# EAGLE design v5 (EAGLE 6.3)

## Sheet 1 of 3
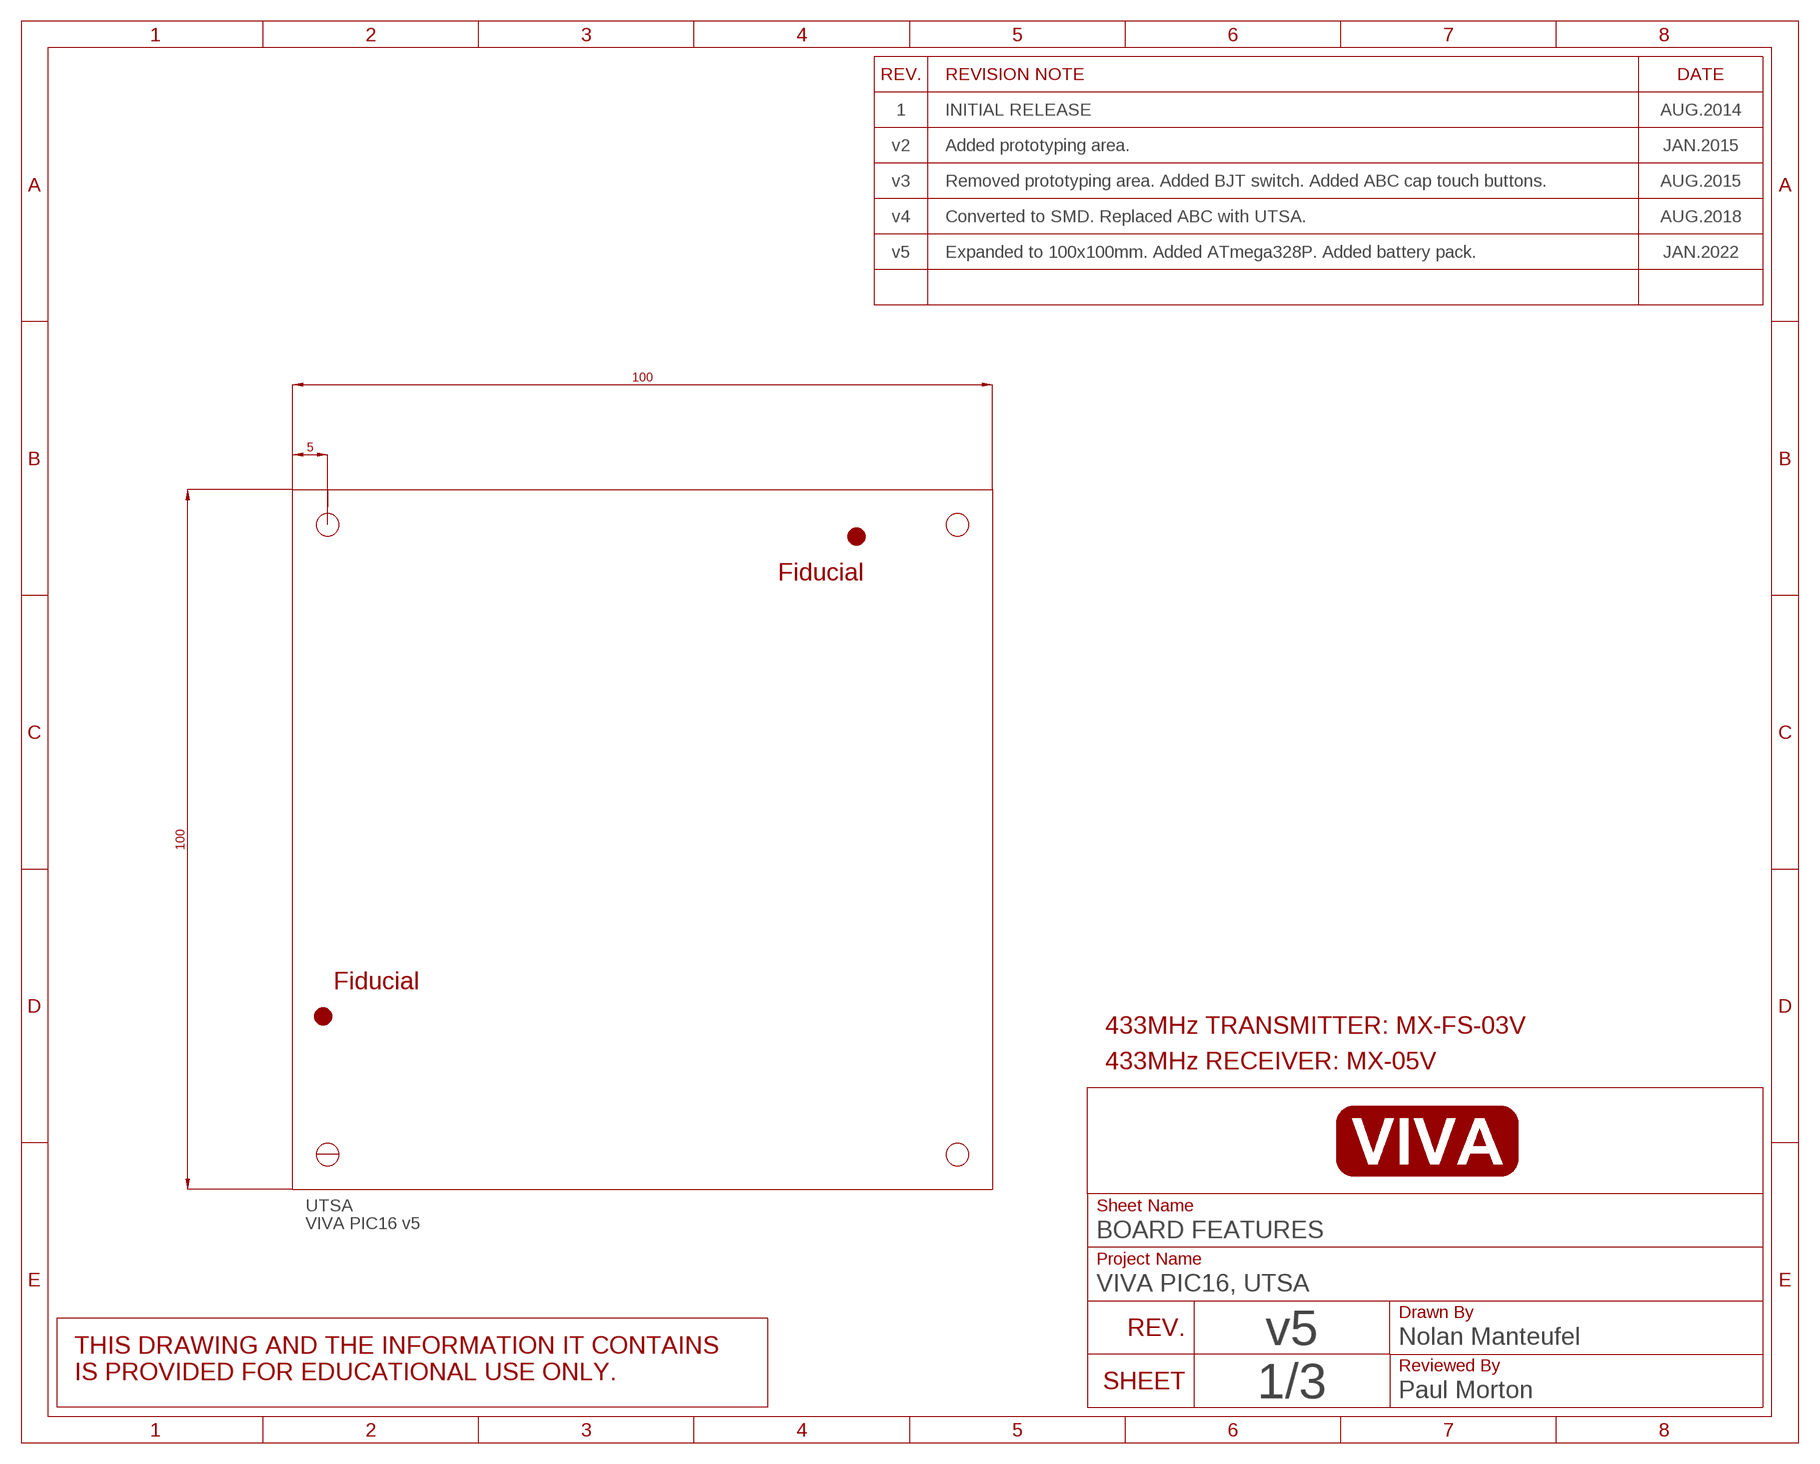
[diagram p0: schematic, sheet 1]
U$1 (SCHEMATIC_VIVA): DRAWN_BY: Nolan Manteufel; PROJECT: VIVA PIC16, UTSA; REVA: 1; REVA_DATE: AUG.2014; REVA_NOTE: INITIAL RELEASE; REVB: v2; REVB_DATE: JAN.2015; REVB_NOTE: Added prototyping area.; REVC: v3; REVC_DATE: AUG.2015; REVC_NOTE: Removed prototyping area. Added BJT switch. Added ABC cap touch buttons.; REVD: v4; REVD_DATE: AUG.2018; REVD_NOTE: Converted to SMD. Replaced ABC with UTSA.; REVE: v5; REVE_DATE: JAN.2022; REVE_NOTE: Expanded to 100x100mm. Added ATmega328P. Added battery pack.; REVIEWED_BY: Paul Morton; REVISION: v5

### Parts
FIDUCIAL1  FIDUCIAL  [FIDUCIAL]
FIDUCIAL2  FIDUCIAL  [FIDUCIAL]
UTSA  VIVA PIC16 v5  PCB_100X100  [PCB_100X100]

### Notes on the sheet
- Fiducial
- Fiducial
- 433MHz TRANSMITTER: MX-FS-03V
- 433MHz RECEIVER: MX-05V

## Sheet 2 of 3
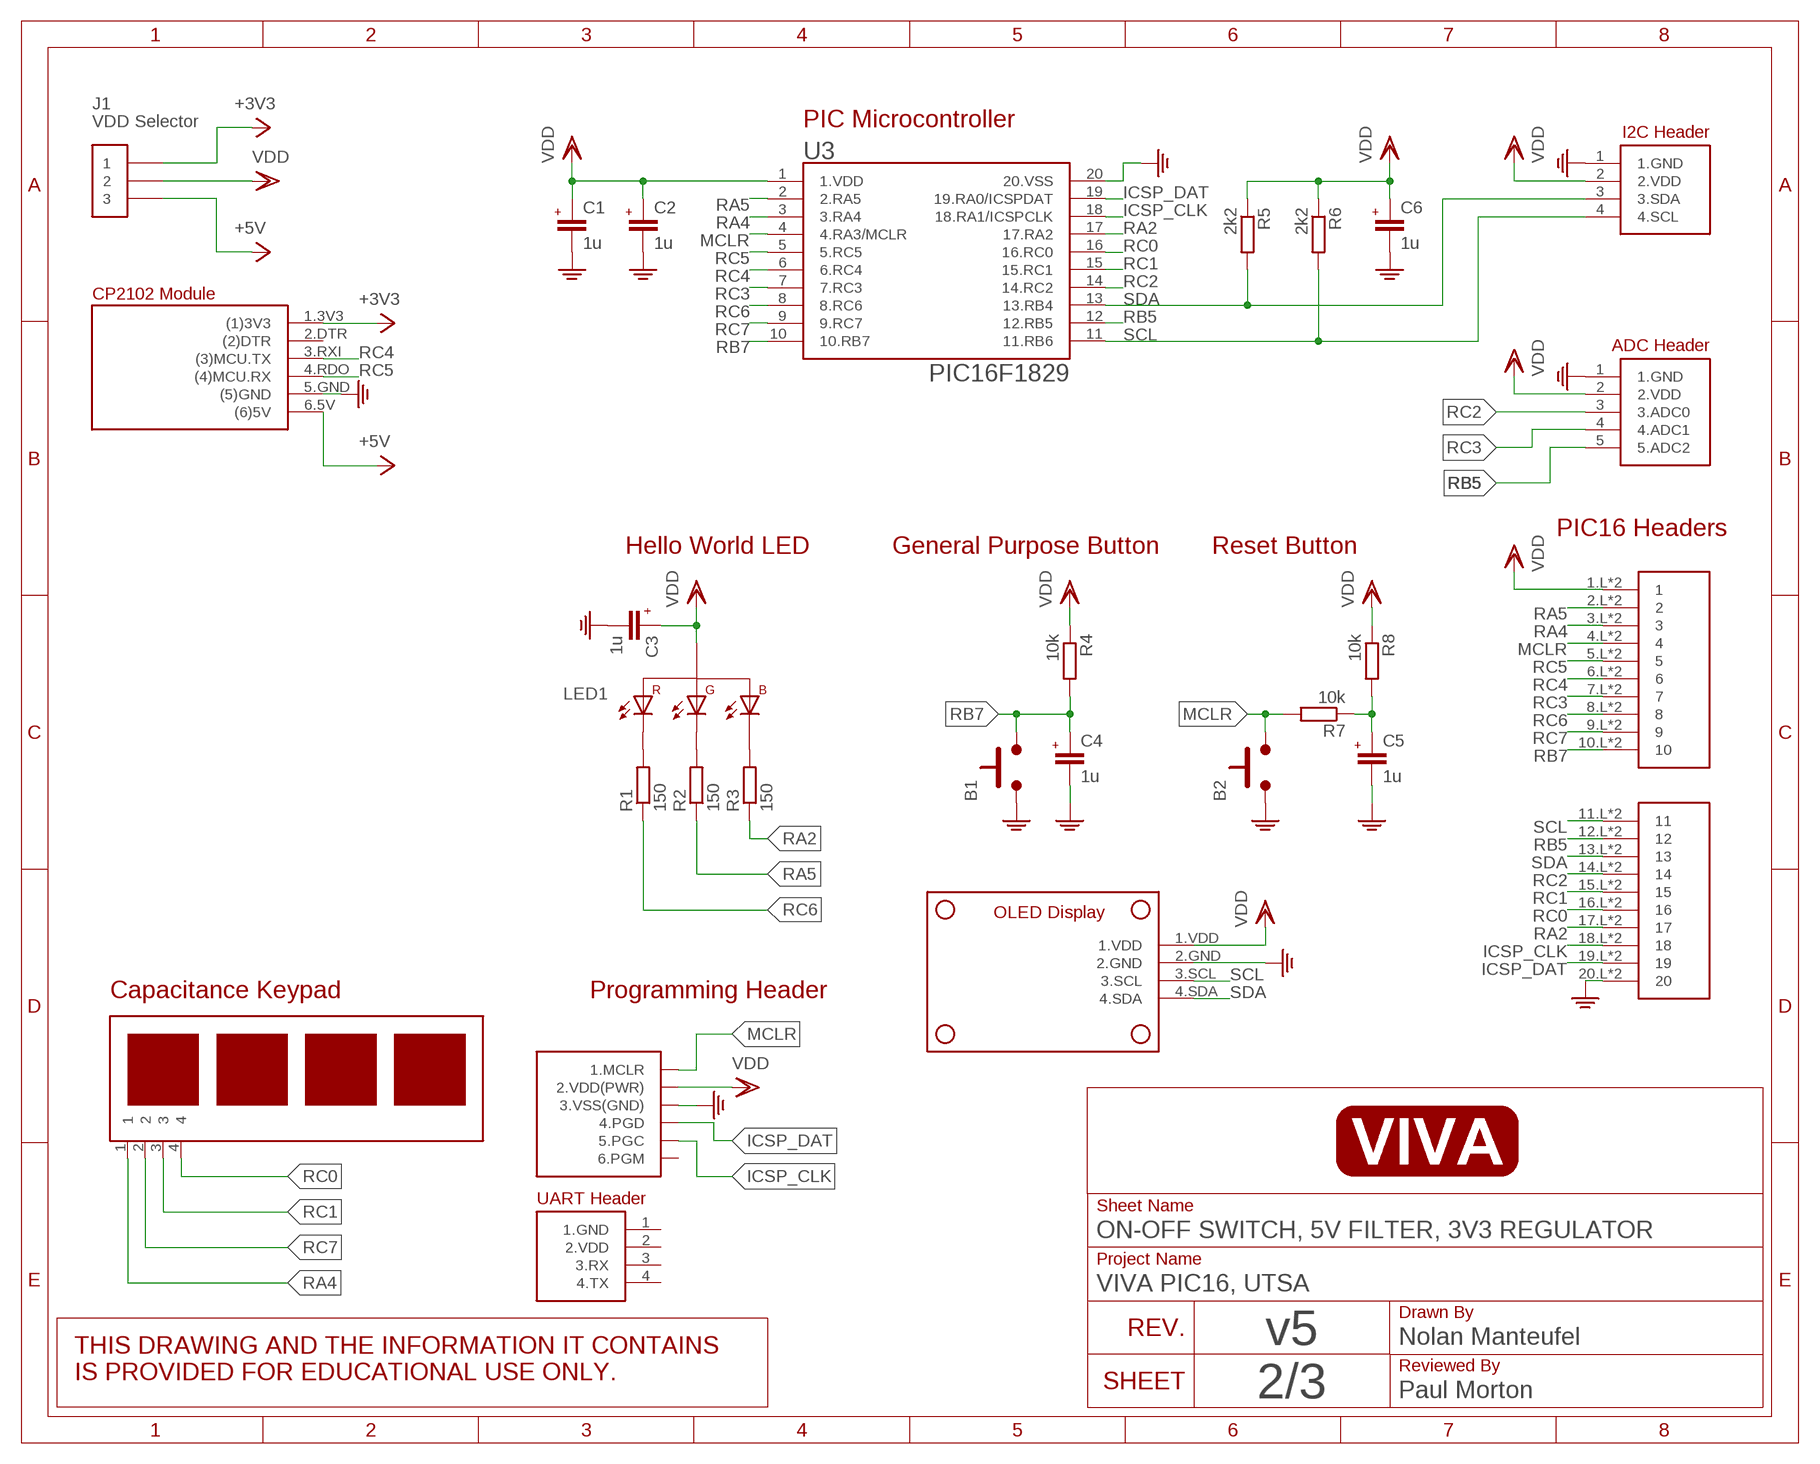
[diagram p1: schematic, sheet 2]
U$4 (SCHEMATIC_VIVA): DRAWN_BY: Nolan Manteufel; PROJECT: VIVA PIC16, UTSA; REVA: 1; REVA_DATE: AUG.2014; REVA_NOTE: INITIAL RELEASE; REVB: v2; REVB_DATE: JAN.2015; REVB_NOTE: Added prototyping area.; REVC: v3; REVC_DATE: AUG.2015; REVC_NOTE: Removed prototyping area. Added BJT switch. Added ABC cap touch buttons.; REVD: v4; REVD_DATE: AUG.2018; REVD_NOTE: Converted to SMD. Replaced ABC with UTSA.; REVE: v5; REVE_DATE: JAN.2022; REVE_NOTE: Expanded to 100x100mm. Added ATmega328P. Added battey pack.; REVIEWED_BY: Paul Morton; REVISION: v5

### Parts
B1  PUSHBUTTON6X6MM  [6X6MM]
B2  PUSHBUTTON6X6MM  [6X6MM]
C1  1u  C0805  [C0805]
C2  1u  C0805  [C0805]
C3  1u  C0805  [C0805]
C4  1u  C0805  [C0805]
C5  1u  C0805  [C0805]
C6  1u  C0805  [C0805]
J1  VDD Selector  PINS_3_2.54  [PINS_3]
J4  PICKIT3  [PICKIT3]
J5  VIVA-HEADER-ADC-PIC16  [VIVA-HEADER-ADC-PIC16]
LED1  LED_RGBLTST-C19FD1WT  [0805_RGB]
R1  150  R-EU__R0805  [R0805]
R2  150  R-EU__R0805  [R0805]
R3  150  R-EU__R0805  [R0805]
R4  10k  R-EU__R0805  [R0805]
R5  2k2  R-EU__R0805  [R0805]
R6  2k2  R-EU__R0805  [R0805]
R7  10k  R-EU__R0805  [R0805]
R8  10k  R-EU__R0805  [R0805]
U1  VIVA_UTSA-KEYPADV5  [VIVA_UTSA-KEYPAD-V5]
U2  VIVA_USB-TTL  [VIVA_USB_TTL_SUBTEXT]
U3  PIC16F1829  PIC16F1829300  [SOP20-NEW]
U4  VIVA-HEADER-I2C-RA  [VIVA-HEADER-I2C-RA]
U5  VIVA_PIC16BOARD  [VIVA_PIC16]
U$2  VIVA-HEADER-UART-XS  [PINS_4]
U$3  VIVA_OLED  [VIVA_OLED-I2C]

### Nets
+3V3: J1.1 U2.1.3V3((1)3V3) ; also sheet 3
+5V: J1.3 U2.6.5V((6)5V) ; also sheet 3
GND: B1.1.A B1.2.A B2.1.A B2.2.A C1.1(-) C2.1(-) C3.1(-) C4.1(-) C5.1(-) C6.1(-) J4.3(3.VSS(GND)) J5.1(1.GND) U2.5.GND((5)GND) U3.20(20.VSS) U4.1(1.GND) U5.20.L U5.20.R U$3.2.GND ; also sheet 3
ICSP_CLK: J4.5(5.PGC) U3.18(18.RA1/ICSPCLK) U5.18.L U5.18.R
ICSP_DAT: J4.4(4.PGD) U3.19(19.RA0/ICSPDAT) U5.19.L U5.19.R
MCLR: B2.3.B B2.4.B J4.1(1.MCLR) R7.2 U3.4(4.RA3/MCLR) U5.4.L U5.4.R
MCLR_CAP: C5.2(+) R7.1 R8.2
N$4: LED1.2(1.R-) R1.2
N$5: LED1.3(2.G-) R2.2
N$6: LED1.1(4.B-) R3.2
RA2: R3.1 U3.17(17.RA2) U5.17.L U5.17.R
RA4: U1.1 U3.3(3.RA4) U5.3.L U5.3.R
RA5: R2.1 U3.2(2.RA5) U5.2.L U5.2.R
RB5: J5.5(5.ADC2) U3.12(12.RB5) U5.12.L U5.12.R
RB7: B1.3.B B1.4.B C4.2(+) R4.2 U3.10(10.RB7) U5.10.L U5.10.R
RC0: U1.4 U3.16(16.RC0) U5.16.L U5.16.R
RC1: U1.3 U3.15(15.RC1) U5.15.L U5.15.R
RC2: J5.3(3.ADC0) U3.14(14.RC2) U5.14.L U5.14.R
RC3: J5.4(4.ADC1) U3.7(7.RC3) U5.7.L U5.7.R
RC4: U2.3.RXI((3)MCU.TX) U3.6(6.RC4) U5.6.L U5.6.R
RC5: U2.4.RDO((4)MCU.RX) U3.5(5.RC5) U5.5.L U5.5.R
RC6: R1.1 U3.8(8.RC6) U5.8.L U5.8.R
RC7: U1.2 U3.9(9.RC7) U5.9.L U5.9.R
SCL: R6.2 U3.11(11.RB6) U4.4(4.SCL) U5.11.L U5.11.R U$3.3.SCL ; also sheet 3
SDA: R5.2 U3.13(13.RB4) U4.3(3.SDA) U5.13.L U5.13.R U$3.4.SDA ; also sheet 3
VDD: C1.2(+) C2.2(+) C3.2(+) C6.2(+) J1.2 J4.2(2.VDD(PWR)) J5.2(2.VDD) LED1.4(3.+) R4.1 R5.1 R6.1 R8.1 U3.1(1.VDD) U4.2(2.VDD) U5.1.L U5.1.R U$3.1.VDD ; also sheet 3
Unconnected: J4.6(6.PGM) U2.2.DTR((2)DTR) U$2.1(1.GND) U$2.2(2.VDD) U$2.3(3.RX) U$2.4(4.TX)

### Notes on the sheet
- PIC Microcontroller
- PIC16 Headers
- Hello World LED | General Purpose Button | Reset Button
- Capacitance Keypad | Programming Header

## Sheet 3 of 3
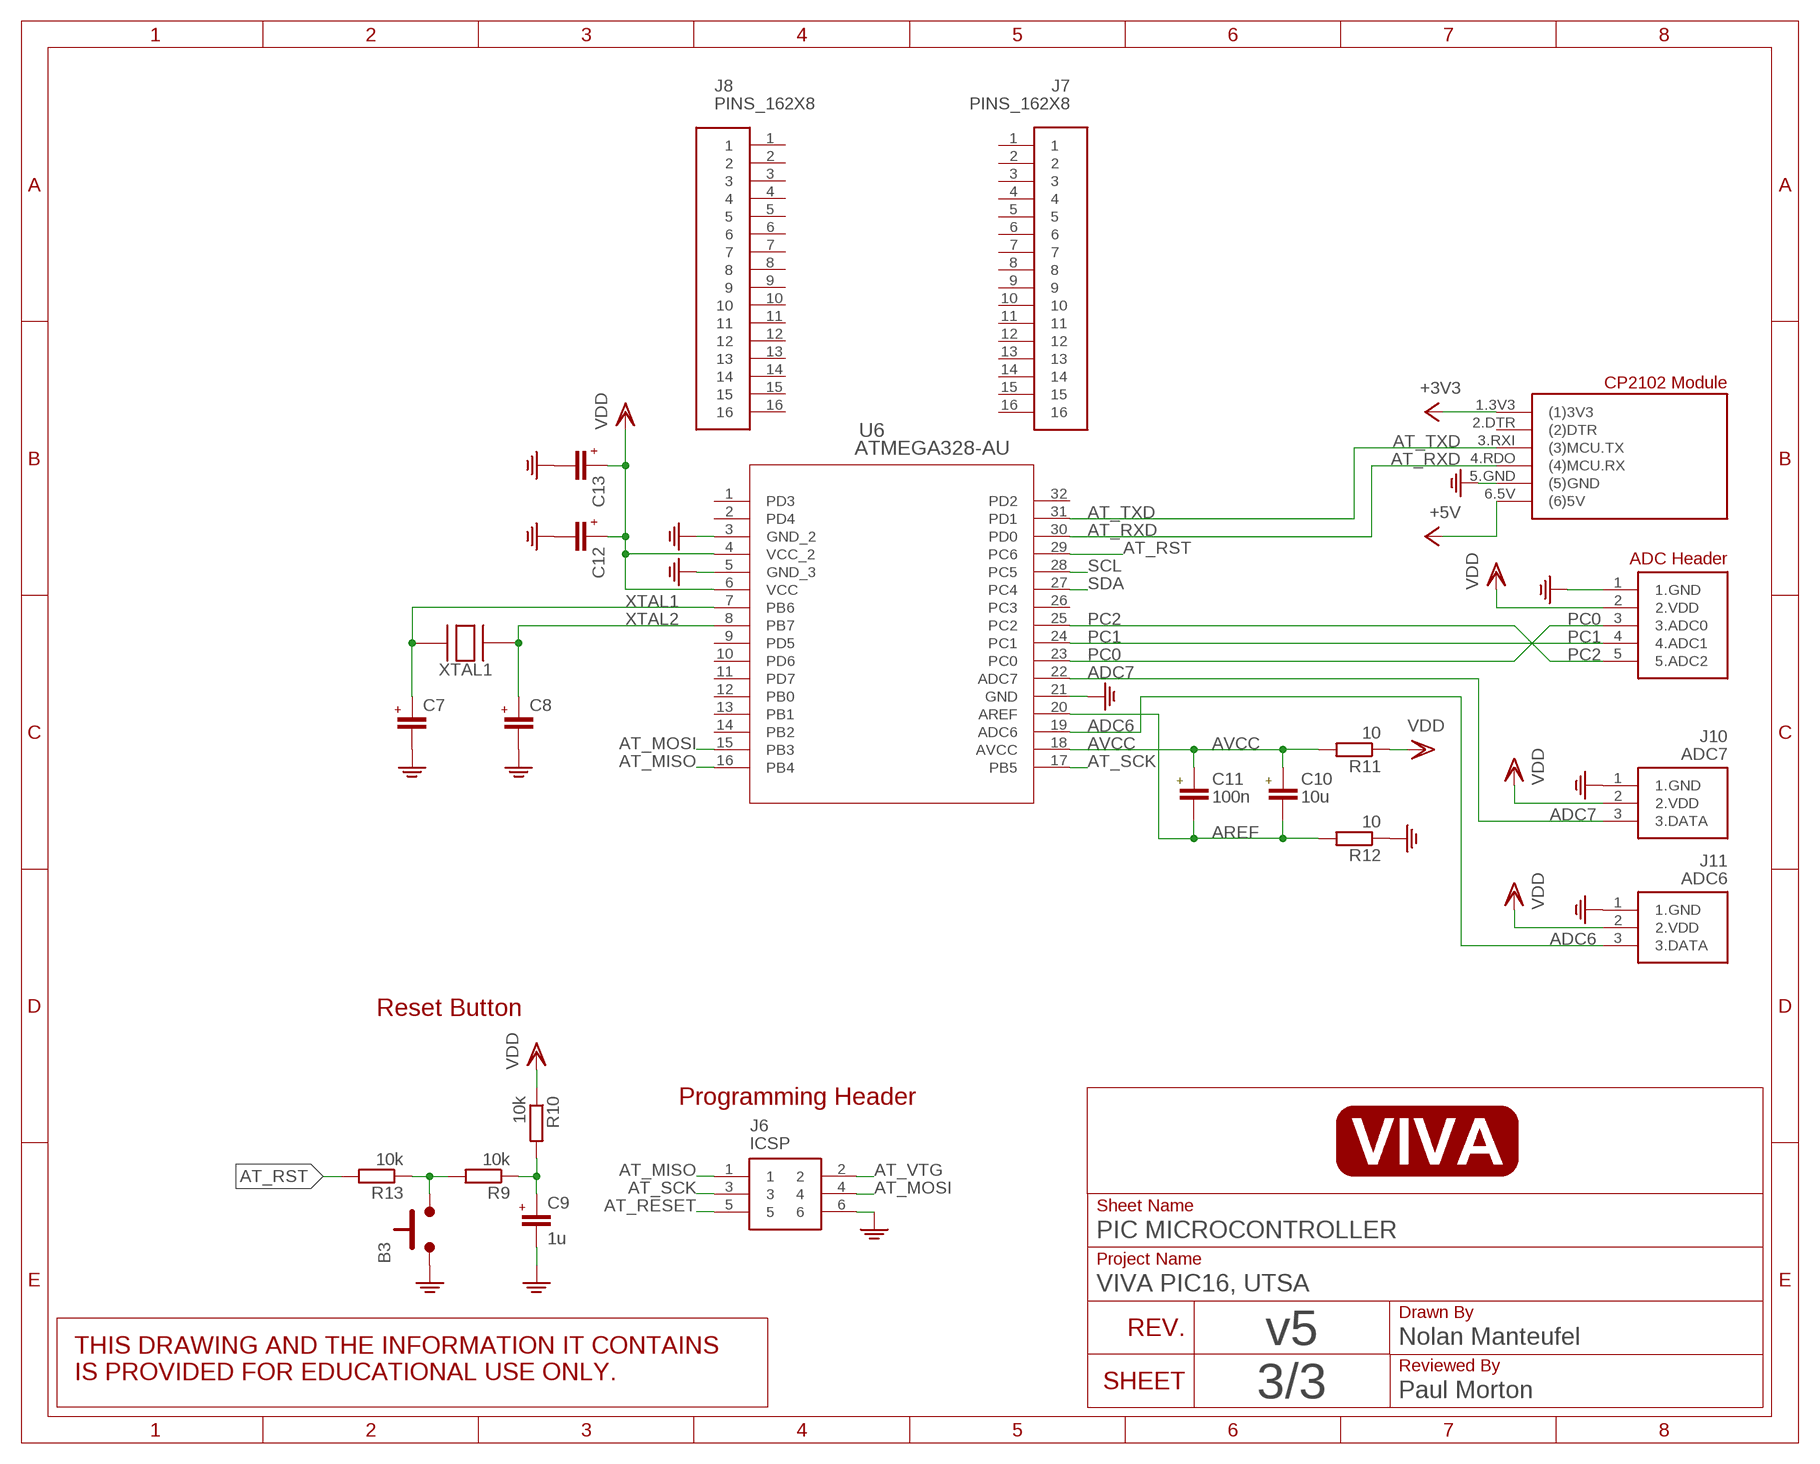
[diagram p2: schematic, sheet 3]
U$5 (SCHEMATIC_VIVA): DRAWN_BY: Nolan Manteufel; PROJECT: VIVA PIC16, UTSA; REVA: 1; REVA_DATE: AUG.2014; REVA_NOTE: INITIAL RELEASE; REVB: v2; REVB_DATE: JAN.2015; REVB_NOTE: Added prototyping area.; REVC: v3; REVC_DATE: AUG.2015; REVC_NOTE: Removed prototyping area. Added BJT switch. Added ABC cap touch buttons.; REVD: v4; REVD_DATE: AUG.2018; REVD_NOTE: Converted to SMD. Replaced ABC with UTSA.; REVE: v5; REVE_DATE: JAN.2022; REVE_NOTE: Expanded to 100x100mm. Added ATmega328P. Added battey pack.; REVIEWED_BY: Paul Morton; REVISION: v5

### Parts
B3  PUSHBUTTON6X6MM  [6X6MM]
C7  C0805  [C0805]
C8  C0805  [C0805]
C9  1u  C0805  [C0805]
C10  10u  C-EU_C0805  [C0805]
C11  100n  C-EU_C0805  [C0805]
C12  C0805  [C0805]
C13  C0805  [C0805]
J6  ICSP  PINS_6-2X3  [PINS_6-2X3]
J7  PINS_162X8  [PINS16_2X8]
J8  PINS_162X8  [PINS16_2X8]
J9  VIVA-HEADER-ADC-PIC16  [VIVA-HEADER-ADC-PIC16]
J10  ADC7  VIVA-HEADER-GPIO-1  [VIVA-HEADER-GPIO-RA-1]
J11  ADC6  VIVA-HEADER-GPIO-1  [VIVA-HEADER-GPIO-RA-1]
R9  10k  R-EU__R0805  [R0805]
R10  10k  R-EU__R0805  [R0805]
R11  10  R-EU__R0805  [R0805]
R12  10  R-EU__R0805  [R0805]
R13  10k  R-EU__R0805  [R0805]
U6  ATMEGA328-AU  [32A_ATM]
U7  VIVA_USB-TTL  [VIVA_USB_TTL_SUBTEXT]
XTAL1  CRYSTAL-SMD  [HC49S-SMD]

### Nets
+3V3: U7.1.3V3((1)3V3) ; also sheet 2
+5V: U7.6.5V((6)5V) ; also sheet 2
ADC6: J11.3(3.DATA) U6.19(ADC6)
ADC7: J10.3(3.DATA) U6.22(ADC7)
AREF: C10.2 C11.2 R12.2 U6.20(AREF)
AT_MISO: J6.1 U6.16(PB4)
AT_MOSI: J6.4 U6.15(PB3)
AT_RESET: J6.5
AT_RST: R13.2 U6.29(PC6)
AT_RST_BTN: B3.3.B B3.4.B R9.2 R13.1
AT_RST_CAP: C9.2(+) R9.1 R10.2
AT_RXD: U6.30(PD0) U7.4.RDO((4)MCU.RX)
AT_SCK: J6.3 U6.17(PB5)
AT_TXD: U6.31(PD1) U7.3.RXI((3)MCU.TX)
AT_VTG: J6.2
AVCC: C10.1 C11.1 R11.2 U6.18(AVCC)
GND: B3.1.A B3.2.A C7.1(-) C8.1(-) C9.1(-) C12.1(-) C13.1(-) J6.6 J9.1(1.GND) J10.1(1.GND) J11.1(1.GND) R12.1 U6.3(GND_2) U6.5(GND_3) U6.21(GND) U7.5.GND((5)GND) ; also sheet 2
PC0: J9.3(3.ADC0) U6.23(PC0)
PC1: J9.4(4.ADC1) U6.24(PC1)
PC2: J9.5(5.ADC2) U6.25(PC2)
SCL: U6.28(PC5) ; also sheet 2
SDA: U6.27(PC4) ; also sheet 2
VDD: C12.2(+) C13.2(+) J9.2(2.VDD) J10.2(2.VDD) J11.2(2.VDD) R10.1 R11.1 U6.4(VCC_2) U6.6(VCC) ; also sheet 2
XTAL1: C7.2(+) U6.7(PB6) XTAL1.2 XTAL1.4
XTAL2: C8.2(+) U6.8(PB7) XTAL1.1 XTAL1.3
Unconnected: J7.1 J7.2 J7.3 J7.4 J7.5 J7.6 J7.7 J7.8 J7.9 J7.10 J7.11 J7.12 J7.13 J7.14 J7.15 J7.16 J8.1 J8.2 J8.3 J8.4 J8.5 J8.6 J8.7 J8.8 J8.9 J8.10 J8.11 J8.12 J8.13 J8.14 J8.15 J8.16 U6.1(PD3) U6.2(PD4) U6.9(PD5) U6.10(PD6) U6.11(PD7) U6.12(PB0) U6.13(PB1) U6.14(PB2) U6.26(PC3) U6.32(PD2) U7.2.DTR((2)DTR)

### Notes on the sheet
- Reset Button
- Programming Header

## Library data of the parts
B1-B3 = nolan-utsa:PUSHBUTTON: Tactile push button switch
C1-C9 C12 C13 = utsa:C
C10 C11 = utsa:C-EU: CAPACITOR, European symbol
FIDUCIAL1 FIDUCIAL2 = utsa:FIDUCIAL
J1 = utsa:PINS_3
J4 = nolan-viva:PICKIT3
J5 J9 = utsa:VIVA-HEADER-ADC
J6 = utsa:PINS_6-2X3
J7 J8 = utsa:PINS_16
J10 J11 = utsa:VIVA-HEADER-GPIO-1
LED1 = utsa:LED_RGB
R1-R13 = utsa:R-EU_: RESISTOR, European symbol
U1 = utsa:VIVA_UTSA-KEYPAD
U2 U7 = utsa:VIVA_USB-TTL
U3 = utsa:PIC16F1829
U4 = utsa:VIVA-HEADER-I2C
U5 = utsa:VIVA_PIC16
U6 = utsa:ATMEGA328-AU; COPYRIGHT: Copyright (C) 2021 Ultra Librarian. All rights reserved.; MANUFACTURER_PART_NUMBER: ATMEGA328-AU; MFR_NAME: Microchip
U$2 = utsa:VIVA-HEADER-UART
U$3 = utsa:VIVA_OLED
UTSA = utsa:PCB_100X100
XTAL1 = utsa:CRYSTAL: HC49S Crystal Oscillator

## Board
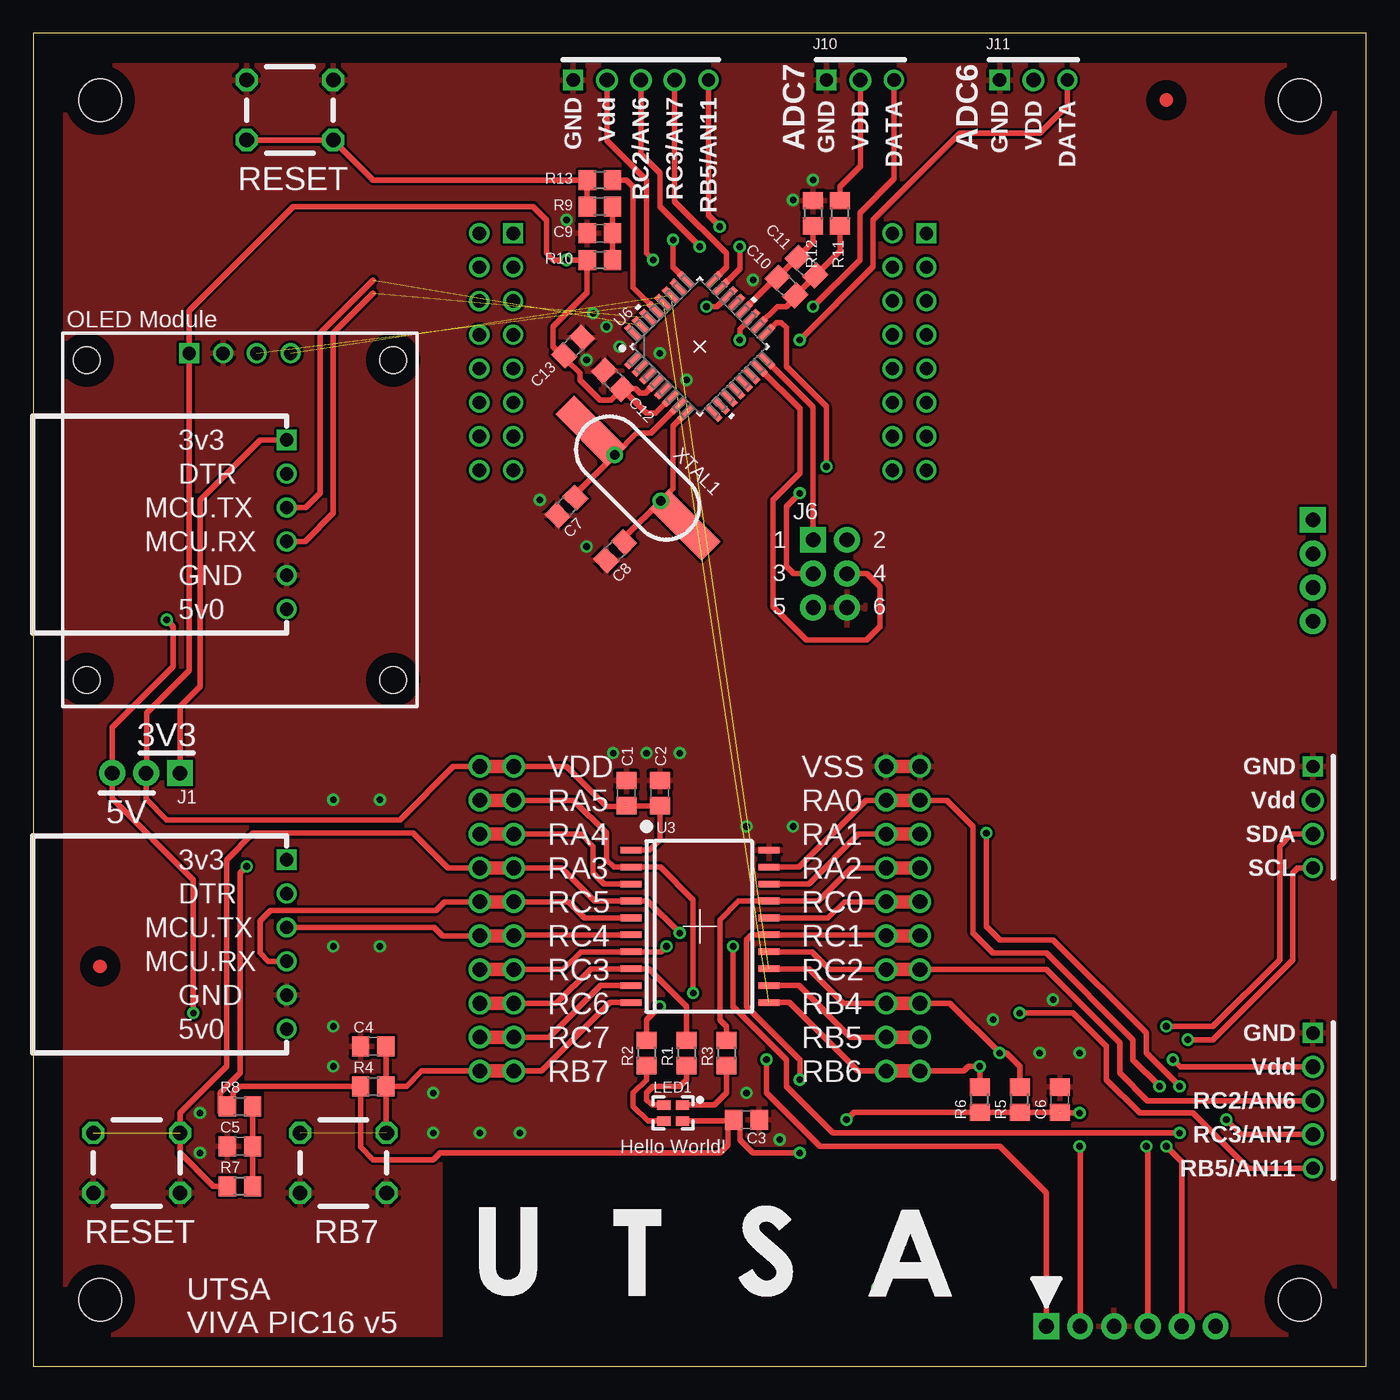
[diagram p3: board, top side]
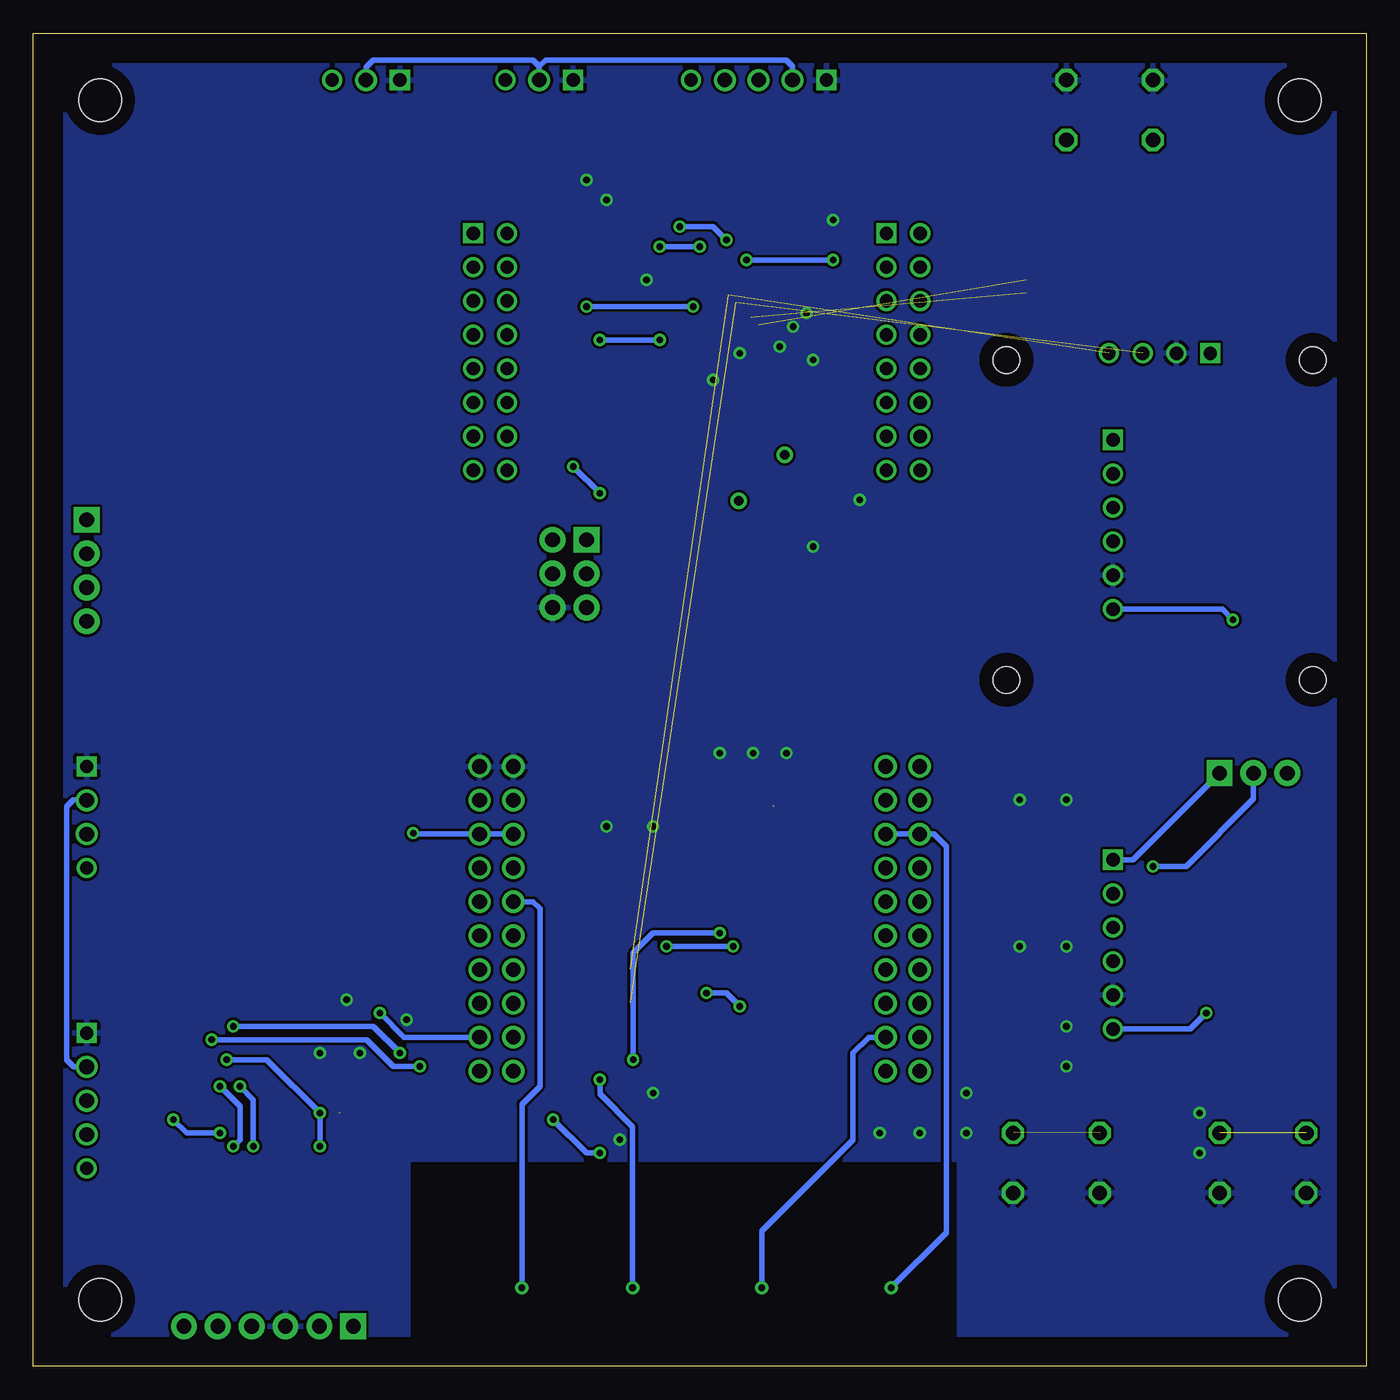
[diagram p4: board, bottom side, seen from below]

Size 100 x 100 mm. Coordinates in mm from the lower left corner, seen from the top.
Copper layers (1*2*15*16): Top 0.035mm / dielectric 0.2mm / Route2 0.035mm / dielectric 0.15mm / Route15 0.035mm / dielectric 0.2mm / Bottom 0.035mm
Design rules "default *": minimum track width 10mil, minimum drill 24mil, track to track 8mil, track to pad 8mil, pad to pad 8mil, via to via 8mil, smd to smd 8mil, copper to edge 40mil, drill to drill 8mil, minimum pad ring 10mil, minimum via ring 8mil, stop-mask expansion 4mil, vias tented up to drill 20mil, thermal gap 10mil
tRestrict: area 59.2,55.2 to 62.8,58.8; area 79.4,1.4 to 82.6,4.6

### Footprints (pad centres in the part's own frame; a part is rotated, then mirrored left to right if it is on the bottom)
6X6MM = drill 1.1 octagon: 1.A 0,0; 2.A 6.5,0; 3.B 0,4.5; 4.B 6.5,4.5
C0805 = smd 1.3 x 1.5: 1 -0.95,0; 2 0.95,0
FIDUCIAL = smd 0 x 0: FIDUCIAL 0,0
PINS_3 = drill 1.1 pad 1.93 square: 1 0,0 | drill 1.1 pad 1.93: 2 2.54,0; 3 5.08,0
PICKIT3 = drill 1.1 pad 1.93 square: 1 0,0 | drill 1.1 pad 1.93: 2 2.54,0; 3 5.08,0; 4 7.62,0; 5 10.16,0; 6 12.7,0
VIVA-HEADER-ADC-PIC16 = drill 1 square: 1 0,0 | drill 1.1: 2 2.54,0; 3 5.08,0; 4 7.62,0 | drill 1: 5 10.16,0
PINS_6-2X3 = drill 1.1 pad 1.93 square: 1 0,0 | drill 1.1 pad 1.93: 2 2.54,0; 3 0,-2.54; 4 2.54,-2.54; 5 0,-5.08; 6 2.54,-5.08
PINS16_2X8 = drill 1 square: 1 0,0 | drill 1: 2 0,-2.54; 3 2.54,0; 4 2.54,-2.54; 5 5.08,0; 6 5.08,-2.54; 7 7.62,0; 8 7.62,-2.54; 9 10.16,0; 10 10.16,-2.54; 11 12.7,0; 12 12.7,-2.54; 13 15.24,0; 14 15.24,-2.54; 15 17.78,0; 16 17.78,-2.54
VIVA-HEADER-GPIO-RA-1 = drill 1 square: 1 0,0 | drill 1.1: 2 0,-2.54 | drill 1: 3 0,-5.08
0805_RGB = smd 1 x 0.7: 1 0.7,0.6; 2 -0.7,0.6; 3 -0.7,-0.6; 4 0.7,-0.6
R0805 = smd 1.3 x 1.5: 1 -0.95,0; 2 0.95,0
VIVA_UTSA-KEYPAD-V5 = drill 0.5: 1 -14.36,4.38; 2 -4.66,4.38; 3 5.04,4.38; 4 13.34,4.38
VIVA_USB_TTL_SUBTEXT = drill 1 square: 1.3V3 0,0 | drill 1: 2.DTR 0,-2.54; 3.RXI 0,-5.08; 4.RDO 0,-7.62; 5.GND 0,-10.16; 6.5V 0,-12.7
SOP20-NEW = smd 0.5 x 1.6: 1 -5.715,-5.152; 2 -4.445,-5.152; 3 -3.175,-5.152; 4 -1.905,-5.152; 5 -0.635,-5.152; 6 0.635,-5.152; 7 1.905,-5.152; 8 3.175,-5.152; 9 4.445,-5.152; 10 5.715,-5.152; 11 5.715,5.188; 12 4.445,5.188; 13 3.175,5.188; 14 1.905,5.188; 15 0.635,5.188; 16 -0.635,5.188; 17 -1.905,5.188; 18 -3.175,5.188; 19 -4.445,5.188; 20 -5.715,5.188
VIVA-HEADER-I2C-RA = drill 1 square: 1 0,0 | drill 1.1: 2 2.54,0; 3 5.08,0 | drill 1: 4 7.62,0
VIVA_PIC16 = drill 1.1 pad 1.676: 1.L 0,0; 1.R 2.54,0; 2.L 0,-2.54; 2.R 2.54,-2.54; 3.L 0,-5.08; 3.R 2.54,-5.08; 4.L 0,-7.62; 4.R 2.54,-7.62; 5.L 0,-10.16; 5.R 2.54,-10.16; 6.L 0,-12.7; 6.R 2.54,-12.7; 7.L 0,-15.24; 7.R 2.54,-15.24; 8.L 0,-17.78; 8.R 2.54,-17.78; 9.L 0,-20.32; 9.R 2.54,-20.32; 10.L 0,-22.86; 10.R 2.54,-22.86; 11.L 30.48,-22.86; 11.R 33.02,-22.86; 12.L 30.48,-20.32; 12.R 33.02,-20.32; 13.L 30.48,-17.78; 13.R 33.02,-17.78; 14.L 30.48,-15.24; 14.R 33.02,-15.24; 15.L 30.48,-12.7; 15.R 33.02,-12.7; 16.L 30.48,-10.16; 16.R 33.02,-10.16; 17.L 30.48,-7.62; 17.R 33.02,-7.62; 18.L 30.48,-5.08; 18.R 33.02,-5.08; 19.L 30.48,-2.54; 19.R 33.02,-2.54; 20.L 30.48,0; 20.R 33.02,0
32A_ATM = smd 1.461 x 0.501: 1 -4.25,2.8; 2 -4.25,2; 3 -4.25,1.2; 4 -4.25,0.4; 5 -4.25,-0.4; 6 -4.25,-1.2; 7 -4.25,-2; 8 -4.25,-2.8; 17 4.25,-2.8; 18 4.25,-2; 19 4.25,-1.2; 20 4.25,-0.4; 21 4.25,0.4; 22 4.25,1.2; 23 4.25,2; 24 4.25,2.8 | smd 0.501 x 1.461: 9 -2.8,-4.25; 10 -2,-4.25; 11 -1.2,-4.25; 12 -0.4,-4.25; 13 0.4,-4.25; 14 1.2,-4.25; 15 2,-4.25; 16 2.8,-4.25; 25 2.8,4.25; 26 2,4.25; 27 1.2,4.25; 28 0.4,4.25; 29 -0.4,4.25; 30 -1.2,4.25; 31 -2,4.25; 32 -2.8,4.25
PINS_4 = drill 1.1 pad 1.93 square: 1 0,0 | drill 1.1 pad 1.93: 2 2.54,0; 3 5.08,0; 4 7.62,0
VIVA_OLED-I2C = drill 1 square: 1.VDD -3.81,12.5 | drill 1: 2.GND -1.27,12.5; 3.SCL 1.27,12.5; 4.SDA 3.81,12.5 | hole 2: -11.5,12; 11.5,12; -11.5,-12; 11.5,-12
PCB_100X100 = hole 3.2: 5,95; 95,95; 95,5; 5,5
HC49S-SMD = drill 0.7: 1 -2.44,0; 2 2.44,0 | smd 5.5 x 2: 3 -5,0; 4 5,0

### Placement (x,y rotation side)
B1  20,13 0 top
B2  4.5,13 0 top
B3  22.5,96.5 180 top
C1  44.5,43 270 top
C2  47,43 270 top
C3  53.5,18.5 180 top
C4  25.5,24 0 top
C5  15.5,16.5 0 top
C6  77,20 270 top
C7  40,64.5 45 top
C8  43.65,61.15 45 top
C9  42.5,85 0 top
C10  56.5,81 135 top
C11  58,82.5 135 top
C12  43.5,74 315 top
C13  40.5,76.5 225 top
FIDUCIAL1  85,95 0 top
FIDUCIAL2  5,30 0 top
J1  11,44.5 180 top
J4  76,3 0 top
J5  96,25 270 top
J6  58.5,62 0 top
J7  36,85 270 top
J8  67,85 270 top
J9  40.5,96.5 0 top
J10  59.5,96.5 90 top
J11  72.5,96.5 90 top
LED1  48,19 0 top
R1  49,23.5 270 top
R2  46,23.5 270 top
R3  52,23.5 270 top
R4  25.5,21 0 top
R5  74,20 90 top
R6  71,20 90 top
R7  15.5,13.5 180 top
R8  15.5,19.5 0 top
R9  42.5,87 180 top
R10  42.5,83 0 top
R11  60.5,86.5 270 top
R12  58.5,86.5 270 top
R13  42.5,89 0 top
U1  50,1.5 0 top
U2  19,38 0 top
U3  50,33 270 top
U4  96,45 270 top
U5  33.5,45 0 top
U6  50,76.5 45 top
U7  19,69.5 0 top
U$2  96,63.5 270 top
U$3  15.5,63.5 0 top
UTSA  0,0 0 top
XTAL1  45.35,66.65 135 top

### Tracks (layer width: path | path; a pad name or v marks a point on that pad's centre or on a via)
+3V3
  Top 0.406: J1.1 11,49.5 12.5,51 12.5,65 17,69.5 U7.1.3V3
  Bottom 0.406: J1.1 17.5,38 U2.1.3V3
+5V  (via drill 0.5)
  Top 0.406: v12,26.5 12,36.5 5.92,42.58 J1.3 5.92,47.92 10.5,52.5 10.5,55.5 v10,56
  Bottom 0.406: U2.6.5V 13.2,25.3 v12,26.5 | v10,56 10.8,56.8 U7.6.5V
ADC6  (via drill 0.5)
  Top 0.406: U6.19 53,77.8 v53,77 | v57.5,77 63,82.5 63,86 69.5,92.5 75.5,92.5 77.58,94.58 J11.3
  Bottom 0.406: v53,77 v57.5,77
ADC7  (via drill 0.5)
  Top 0.406: U6.22 51.3,79.5 v50.5,79.5 | v58.5,79.5 62,83 62,86.5 64.58,89.08 J10.3
  Bottom 0.406: v50.5,79.5 v58.5,79.5
AREF
  Top 0.406: U6.20 55.74,81.67 C10.2 C11.2 58.5,84.34 R12.2
AT_MISO
  Top 0.406: J6.1 58.5,71.96 U6.16
AT_MOSI
  Top 0.406: J6.4 62.54,59.46 63.5,58.5 63.5,55.5 62.5,54.5 58,54.5 55.5,57 55.5,65 57.5,67 57.5,71.83 U6.15
AT_RST
  Top 0.406: R13.2 44.5,89 45,88.5 45,80.93 U6.29
AT_RST_BTN
  Top 0.406: R9.2 R13.1 25.5,89 B3.3.B B3.4.B
AT_RST_CAP
  Top 0.406: R9.1 C9.2 R10.2
AT_RXD  (1 unrouted)
  Top 0.406: U7.4.RDO 20.38,61.88 22.5,64 22.5,77.5 25.5,80.5
AT_SCK  (via drill 0.5)
  Top 0.406: J6.3 57.04,59.46 56.5,60 56.5,64.5 v57.5,65.5 | U6.17 55.76,78.3 56.1,78.3 56.5,77.9 56.5,75 59.5,72 v59.5,67.5
  Bottom 0.406: v57.5,65.5 v59.5,67.5
AT_TXD  (1 unrouted)
  Top 0.406: U7.3.RXI 20.42,64.42 21.5,65.5 21.5,77.5 25.5,81.5
AVCC
  Top 0.406: U6.18 55.83,79.5 56.5,79.5 57.17,80.17 C10.1 C11.1 60.5,83.66 R11.2
GND  (via drill 0.5)
  other vias: 53.5,40.5 57,40.5 75.5,23.5 78.5,23.5 56,17 53.5,20.5 43.5,46 46,46 48.5,46 12.5,19 12.5,16 30,20.5 30,17.5 33.5,17.5 36.5,17.5 22.5,22.5 22.5,25.5 22.5,31.5 26,31.5 26,42.5 22.5,42.5 54,81.5 57,87.5 58.5,89 47,76 49,74 38,65 41.5,61.5 41.5,75.5 43,78 42,79 44,76.5 40,86 76.5,27.5 72,26
  pour Top: 2,2 98,2 98,98 2,98
  pour Bottom: 2,2 98,2 98,98 2,98
ICSP_CLK  (via drill 0.5)
  Top 0.406: U5.18.L 61.92,39.92 58.17,36.17 U3.18 | v86,21 83.5,23.5 83.5,25 76.5,32 72.5,32 71.5,33 v71.5,40 | v85,16.5 86.16,15.34 J4.5
  Bottom 0.406: v86,21 84.5,19.5 84.5,17 v85,16.5 | v71.5,40 71.42,39.92 U5.18.L
ICSP_DAT  (via drill 0.5)
  Top 0.406: U3.19 57.45,37.45 62.46,42.46 U5.19.R 68.54,42.46 70.5,40.5 70.5,32.5 72,31 76,31 82.5,24.5 82.5,23 v84.5,21 | v83.5,16.5 83.62,16.38 J4.4
  Bottom 0.406: v84.5,21 83.5,20 v83.5,16.5
MCLR  (via drill 0.5)  (1 unrouted)
  Top 0.406: J4.1 76,13 72.5,16.5 59,16.5 55,20.5 v55,23 | v48.5,32.5 46.09,34.91 U3.4 42.09,34.91 39.62,37.38 U5.4.L 31.12,37.38 28.5,40 16.5,40 14.5,38 14.5,22.5 11,19 B2.4.B 11,16 13.5,13.5 R7.2
  Bottom 0.406: v55,23 55,31 53.5,32.5 v48.5,32.5
MCLR_CAP
  Top 0.406: R7.1 C5.2 R8.2
N$4
  Top 0.406: LED1.2 46.4,19.6 46,20 46,20.5 46.5,21 48.5,21 49,21.5 R1.2
N$5
  Top 0.406: LED1.3 46.1,18.4 45,19.5 45,20.5 46,21.5 R2.2
N$6
  Top 0.406: LED1.1 51.1,19.6 52,20.5 R3.2
PC0  (via drill 0.5)
  Top 0.406: U6.23 53,82.33 v53,84 | v50,84 47,87 47,89.5 45.58,90.92 J9.3
  Bottom 0.406: v53,84 v50,84
PC1
  Top 0.406: U6.24 52,82.46 52,83.5 48.12,87.38 J9.4
PC2  (via drill 0.5)
  Top 0.406: U6.25 48,82.46 v48,84.5 | v51.5,85.5 50.66,86.34 J9.5
  Bottom 0.406: v48,84.5 49,85.5 v51.5,85.5
RA2
  Top 0.406: U5.17.L 61.38,37.38 58.91,34.91 U3.17 52.91,34.91 51.5,33.5 51.5,26 52,25.5 R3.1
RA4
  Top 0.406: U5.3.R 41.08,39.92 42,39 42,37 42.83,36.17 U3.3
  Bottom 0.406: U5.3.R 32.42,39.92 31.5,39 31.5,10.02 U1.1
RA5  (via drill 0.5)
  Top 0.406: U5.2.R 40.54,42.46 43,40 43,38 43.55,37.45 U3.2 47.05,37.45 49.5,35 v49.5,28 | v47,27 46,26 R2.1
  Bottom 0.406: v49.5,28 48,28 v47,27
RB5  (via drill 0.5)
  Top 0.406: U5.12.R 61.32,24.68 57.45,28.55 U3.12 | v74,26.5 78,26.5 80.5,24 80.5,21.5 83,19 87,19 91.16,14.84 J5.5
  Bottom 0.406: v74,26.5 72.18,24.68 U5.12.R
RB7  (1 unrouted)
  Top 0.406: U3.10 43.28,27.29 38.14,22.14 U5.10.R 29.14,22.14 28,21 R4.2 | C4.2 R4.2 | R4.2 26.45,17.55 B1.4.B
RC0
  Top 0.406: U5.16.L 60.84,34.84 59.63,33.63 U3.16
  Bottom 0.406: U5.16.L 62.5,34.84 62,34.34 62,21 63.34,19.66 U1.4
RC1  (via drill 0.5)
  Top 0.406: 63.98,32.37 U5.15.L arc90 63.91,32.37 U3.15 53.87,32.37 53.5,32 53.5,27 57.5,23 v57.5,21.5
  Bottom 0.406: U1.3 55.04,17.96 57.5,20.42 v57.5,21.5
RC2
  Top 0.406: U3.14 58.41,31.09 59.74,29.76 U5.14.R 76,29.76 81.5,24.26 81.5,22 83.58,19.92 J5.3
RC3  (via drill 0.5)
  Top 0.406: U5.7.R 39.76,29.76 41.09,31.09 U3.7 47.09,31.09 v47.5,31.5 | v52.5,31.5 52.5,27 56.5,23 56.5,21 60,17.5 v86,17.5 | v89.5,18.5 90.62,17.38 J5.4
  Bottom 0.406: v47.5,31.5 v52.5,31.5 | v86,17.5 88.5,17.5 v89.5,18.5
RC4
  Top 0.406: 36.1,32.37 U5.6.R | U3.6 36.1,32.37 | 36.1,32.37 arc90 U5.6.R | U2.3.RXI 30.08,32.92 30.7,32.3 U5.6.R
RC5
  Top 0.406: U3.5 41.37,33.63 40.16,34.84 U5.5.L 30.84,34.84 30.2,34.2 17.8,34.2 17,33.4 17,31 17.62,30.38 U2.4.RDO
RC6
  Top 0.406: U5.8.L 39.22,27.22 41.83,29.82 U3.8 46.17,29.82 49,27 R1.1
RC7
  Top 0.406: U5.9.R 38.68,24.68 42.55,28.55 U3.9
  Bottom 0.406: U5.9.R 37.32,24.68 38.5,23.5 38.5,17 45.34,10.16 U1.2
SCL  (via drill 0.5)  (2 unrouted)
  Top 0.406: R6.2 v71,22.5 70.17,22.5 69.81,22.14 U5.11.L 61.86,22.14 56.72,27.29 U3.11 | v86.62,24.5 88.5,24.5 94.5,30.5 94.5,37 94.88,37.38 U4.4
  Bottom 0.406: v71,22.5 73,22.5 75,24.5 v86.62,24.5
SDA  (via drill 0.5)  (2 unrouted)
  Top 0.406: R5.2 74,22.5 73,23.5 v72.5,23.5 68.78,27.22 U5.13.R 60.78,27.22 58.17,29.82 U3.13 | v85,25.5 88.5,25.5 93.5,30.5 93.5,39 94.42,39.92 U4.3
  Bottom 0.406: v72.5,23.5 74.5,25.5 v85,25.5
VDD  (via drill 0.5)  (2 unrouted)
  Top 0.406: 44.45,42 43,42 40,45 U5.1.L 31.5,45 27.5,41 10,41 8.46,42.54 J1.2 8.5,44.54 8.5,49 11.69,52.19 U$3.1.VDD 11.69,79.19 19.5,87 37.5,87 38.5,86 38.5,83.5 39,83 v40,83 R10.1 41.55,80.55 39,78 39,76.5 39.67,75.83 C13.2 40,75.5 41,74.5 41,74 42.5,72.5 43.34,72.5 C12.2 | v61,18.5 61.55,19.05 R6.1 R5.1 C6.2 | C1.2 C2.2 47,39.5 46.22,38.72 U3.1 | 77.05,19 v78.5,19 | v16,37.5 15.5,37 15.5,22 14,20.5 14,19.05 R8.1 15,19.95 15,20.5 15.5,21 R4.1 24.55,16.45 25.5,15.5 30,15.5 30.5,16 51.5,16 52.1,16.6 52.1,17.9 52.55,18.35 C3.2 | v57.5,16 54,16 53,17 53,18 52.55,18.45 C3.2 | LED1.4 52.55,18.4 C3.2 | U6.6 46.7,71.5 46,71.5 C12.2 | U6.4 45.93,73 45.5,73 45.17,73.33 C12.2 | R11.1 60.5,88.5 62.04,90.04 J10.2 | J9.2 43.04,91.96 46,89 46,83.5 v46.5,83 | v78.5,16.5 78.54,16.46 J4.2 | v85.5,23 86.04,22.46 J5.2
  Bottom 0.406: v57.5,16 58.5,16 v61,18.5 | v16,37.5 13.5,37.5 8.46,42.54 J1.2 | U4.2 96.04,42.5 97,42.5 97.5,42 97.5,23 96.96,22.46 J5.2 | J10.2 62.04,97.54 | 62.04,97.54 62.5,98 74.5,98 75.04,97.46 J11.2 | v46.5,83 v40,83 | v78.5,16.5 v78.5,19 82.5,23 v85.5,23 | J9.2 43.04,97.54 43.5,98 61.58,98 62.04,97.54
XTAL1
  Top 0.406: C7.2 40.67,65.42 XTAL1.2 | XTAL1.2 45.26,70 46.33,70 U6.7 | XTAL1.2 XTAL1.4
XTAL2
  Top 0.406: C8.2 44.48,62.32 XTAL1.1 | XTAL1.1 48,65.84 48,70.54 U6.8 | XTAL1.1 XTAL1.3

### Text on the board
tPlace: RESET | 3V3 | 5V | Hello World! | RESET | RB7